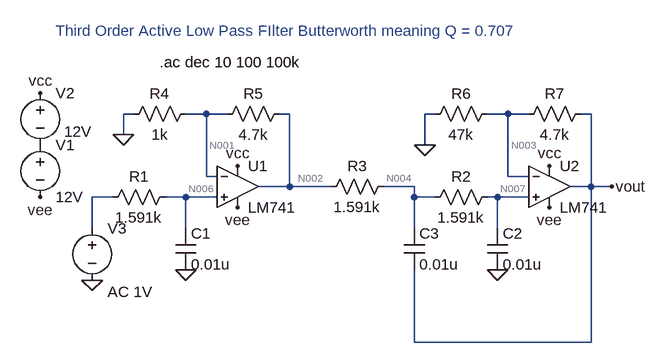
[diagram p0: schematic third_order_low_pass.asc]
third_order_low_pass.asc, the LTspice schematic file:
Version 4.1
SHEET 1 908 680
WIRE 128 144 112 144
WIRE 240 144 208 144
WIRE 272 144 240 144
WIRE 368 144 352 144
WIRE 592 144 576 144
WIRE 704 144 672 144
WIRE 736 144 704 144
WIRE 832 144 816 144
WIRE 112 176 112 144
WIRE 576 192 576 144
WIRE 240 240 240 144
WIRE 256 240 240 240
WIRE 704 240 704 144
WIRE 736 240 704 240
WIRE 368 256 368 144
WIRE 368 256 320 256
WIRE 432 256 368 256
WIRE 560 256 512 256
WIRE 832 256 832 144
WIRE 832 256 800 256
WIRE 864 256 832 256
WIRE 96 272 64 272
WIRE 208 272 176 272
WIRE 256 272 208 272
WIRE 560 272 560 256
WIRE 592 272 560 272
WIRE 688 272 672 272
WIRE 736 272 688 272
WIRE 64 320 64 272
WIRE 208 320 208 272
WIRE 560 320 560 272
WIRE 688 320 688 272
WIRE 560 496 560 384
WIRE 832 496 832 256
WIRE 832 496 560 496
FLAG 288 224 vcc
FLAG -16 112 vcc
FLAG -16 272 vee
FLAG 288 288 vee
FLAG 768 224 vcc
FLAG 768 288 vee
FLAG 64 400 0
FLAG 864 256 vout
FLAG 688 384 0
FLAG 208 384 0
FLAG 112 176 0
FLAG 576 192 0
SYMBOL voltage -16 176 R0
WINDOW 123 0 0 Left 0
WINDOW 39 0 0 Left 0
SYMATTR InstName V1
SYMATTR Value 12V
SYMBOL voltage -16 96 R0
WINDOW 3 37 75 Left 2
WINDOW 123 0 0 Left 0
WINDOW 39 0 0 Left 0
SYMATTR InstName V2
SYMATTR Value 12V
SYMBOL LM741 288 192 R0
SYMATTR InstName U1
SYMBOL LM741 768 192 R0
SYMATTR InstName U2
SYMBOL cap 192 320 R0
SYMATTR InstName C1
SYMATTR Value 0.01u
SYMBOL cap 672 320 R0
SYMATTR InstName C2
SYMATTR Value 0.01u
SYMBOL cap 544 320 R0
SYMATTR InstName C3
SYMATTR Value 0.01u
SYMBOL res 192 256 R90
WINDOW 0 0 56 VBottom 2
WINDOW 3 32 56 VTop 2
SYMATTR InstName R1
SYMATTR Value 1.591k
SYMBOL voltage 64 304 R0
WINDOW 123 24 114 Left 2
WINDOW 39 0 0 Left 0
SYMATTR InstName V3
SYMATTR Value ""
SYMATTR Value2 AC 1V
SYMBOL res 688 256 R90
WINDOW 0 0 56 VBottom 2
WINDOW 3 32 56 VTop 2
SYMATTR InstName R2
SYMATTR Value 1.591k
SYMBOL res 528 240 R90
WINDOW 0 0 56 VBottom 2
WINDOW 3 32 56 VTop 2
SYMATTR InstName R3
SYMATTR Value 1.591k
SYMBOL res 224 128 R90
WINDOW 0 0 56 VBottom 2
WINDOW 3 32 56 VTop 2
SYMATTR InstName R4
SYMATTR Value 1k
SYMBOL res 368 128 R90
WINDOW 0 0 56 VBottom 2
WINDOW 3 32 56 VTop 2
SYMATTR InstName R5
SYMATTR Value 4.7k
SYMBOL res 688 128 R90
WINDOW 0 0 56 VBottom 2
WINDOW 3 32 56 VTop 2
SYMATTR InstName R6
SYMATTR Value 47k
SYMBOL res 832 128 R90
WINDOW 0 0 56 VBottom 2
WINDOW 3 32 56 VTop 2
SYMATTR InstName R7
SYMATTR Value 4.7k
TEXT 8 16 Left 2 ;Third Order Active Low Pass FIlter Butterworth meaning Q = 0.707
TEXT 168 64 Left 2 !.ac dec 10 100 100k

The netlist it stands for:
* third_order_low_pass.asc
V1 P001 vee 12V
V2 vcc P001 12V
X§U1 N006 N001 vcc vee N002 LM741  ; pins In+ In- V+ V- OUT
X§U2 N007 N003 vcc vee vout LM741  ; pins In+ In- V+ V- OUT
C1 N006 0 0.01u
C2 N007 0 0.01u
C3 N004 vout 0.01u
R1 N006 N005 1.591k
V3 N005 0 AC 1V
R2 N007 N004 1.591k
R3 N004 N002 1.591k
R4 N001 0 1k
R5 N002 N001 4.7k
R6 N003 0 47k
R7 vout N003 4.7k
* Third Order Active Low Pass FIlter Butterworth meaning Q = 0.707
.ac dec 10 100 100k
.lib LM741.lib
.backanno
.end

* Results of the author's LTspice run, read from the files saved beside the schematic
* Operating Point, zero values left out:
*   V(vee) = -22.93 V
*   V(n006) = -97.74 µV
*   V(n001) = 47.36 µV
*   V(n007) = 536.3 µV
*   V(n004) = 634.1 µV
*   V(p001) = -10.93 V
*   V(vcc) = 1.072 V
*   V(n002) = 732 µV
*   V(n003) = 661.7 µV
*   V(vout) = 1.19 mV
*   I(V1) = -3.252 mA
*   I(R2) = -61.5 nA
*   I(R4) = 47.36 nA
*   I(R6) = 14.08 nA
*   I(R7) = 112.3 nA
*   I(V3) = -61.43 nA
*   I(R3) = -61.5 nA
*   I(R5) = 145.7 nA
*   I(V2) = -3.252 mA
*   I(R1) = -61.43 nA
*   Ix(u2:1) = 61.5 nA
*   Ix(u2:2) = 98.24 nA
*   Ix(u2:99) = 1.626 mA
*   Ix(u2:50) = -1.626 mA
*   Ix(u2:28) = -112.3 nA
*   Ix(u1:1) = 61.43 nA
*   Ix(u1:2) = 98.31 nA
*   Ix(u1:99) = 1.626 mA
*   Ix(u1:50) = -1.626 mA
*   Ix(u1:28) = -207.2 nA
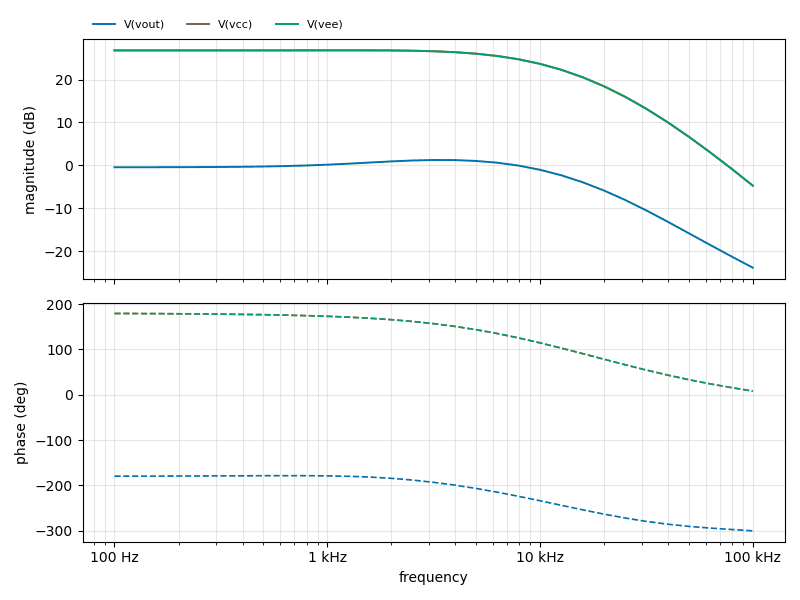
[diagram p1: AC Analysis of third_order_low_pass.asc, plotted from the saved traces]
* AC Analysis, 1 run:
*   V(vout): -0.47 dB at 100 Hz, -23.89 dB at 100 kHz, peak 1.23 dB at 3.162 kHz, 3 dB below the peak at 11.38 kHz
*   V(vcc): 26.79 dB at 100 Hz, -4.76 dB at 100 kHz, peak 26.82 dB at 1.259 kHz, 3 dB below the peak at 9.686 kHz
*   V(vee): 26.79 dB at 100 Hz, -4.76 dB at 100 kHz, peak 26.82 dB at 1.259 kHz, 3 dB below the peak at 9.686 kHz